# Altium schematic sheet ATX.SchDoc
size A4
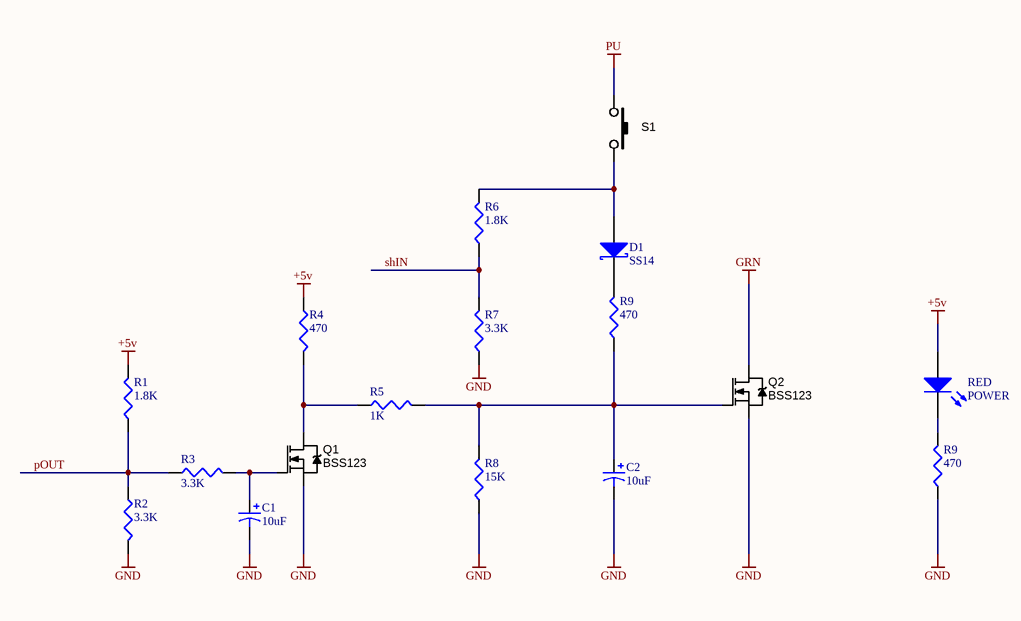
[diagram p0: ATX.SchDoc]

## Parts
(Parts that share a designator on the sheet are numbered #1, #2 ... from top to bottom, then left to right.)
C1  value 10uF  [C0805]  (hidden comment: Cap Pol3)
C2  value 10uF  [C0805]  (hidden comment: Cap Pol3)
D1  SS14  [SMA]
Q1  BSS123  [SOT23-3]
Q2  BSS123  [SOT23-3]
R1  value 1.8K  [J1-0603]  (hidden comment: Res3)
R2  value 3.3K  [J1-0603]  (hidden comment: Res3)
R3  value 3.3K  [J1-0603]  (hidden comment: Res3)
R4  value 470  [J1-0603]  (hidden comment: Res3)
R5  value 1K  [J1-0603]  (hidden comment: Res3)
R6  value 1.8K  [J1-0603]  (hidden comment: Res3)
R7  value 3.3K  [J1-0603]  (hidden comment: Res3)
R8  value 15K  [J1-0603]  (hidden comment: Res3)
R9#1  value 470  [J1-0603]  (hidden comment: Res3)
R9#2  value 470  [J1-0603]  (hidden comment: Res3)
RED  POWER  [3.5X2.8X1.9]
S1  TS-1143S-WP  [TS-1143S]  (value not drawn)

## Nets
+5v: R1.2 R4.1 RED.1(A)
GND: C1.2 C2.2 Q1.2(S) Q2.2(S) R2.2 R7.1 R8.1 R9#2.1
GRN: Q2.3(D)
PU: S1.1
pOUT: R1.1 R2.1 R3.1
shIN: R6.1 R7.2
NetC1_1: C1.1 Q1.1(G) R3.2
NetC2_1: C2.1 Q2.1(G) R5.2 R8.2 R9#1.1
NetD1_1: D1.1(A) R6.2 S1.2
NetD1_2: D1.2(K) R9#1.2
NetQ1_3: Q1.3(D) R4.2 R5.1
NetR9#2_2: R9#2.2 RED.2(K)

## Library data of the parts
C1 C2 = Cap Pol3: Polarized Capacitor (Surface Mount); Published: 8-Jun-2000; LatestRevisionDate: 29-May-2009; LatestRevisionNote: IPC-7351 Footprint Added.; PackageReference: C0805; Publisher: Altium Limited; PackageDescription: Chip Capacitor
D1 = 10MQ060N: Schottky Rectifier; Published: 17-Sep-2003; DatasheetVersion: May-2002; PackageVersion: revH, May-2002; PackageReference: SMA; Publisher: Altium Limited; PackageDescription: DO-214-AC/SMA; 2 C-Bend Leads; Body 5 x 2.7 mm, inc. leads (LxW); ComponentLink1Description: Manufacturer Link; ComponentLink1URL: http://www.irf.com/; ComponentLink2Description: Datasheet; ComponentLink2URL: http://www.irf.com/product-info/datasheets/data/10MQ060N.pdf; Supplier Part Number 1: SS14-E3/61TGICT-ND; Supplier 1: Digi-Key
Q1 Q2 = MOSFET_BSS123: MOSFET SMD N-CH 100V 170mA SOT23-3; Manufacturer 1: Diodes Inc; Manufacturer Part Number 1: BSS123-7-F; Ratings: 100V; 170mA; Material: Metal Oxide; SCDType: source; Package / Case: SOT23-3; Supplier 1: Digi-Key; Supplier Part Number 1: BSS123-FDICT-ND
R1-R8 R9#1 R9#2 = Res3: Resistor; Published: 8-Jun-2000; LatestRevisionDate: 29-May-2009; LatestRevisionNote: IPC-7351 Footprint Added.; PackageReference: J1-0603; Publisher: Altium Limited; PackageDescription: Chip Resistor
RED = LED3: Typical BLUE SiC LED; Published: 8-Jun-2000; LatestRevisionDate: 17-Dec-2003; LatestRevisionNote: PCB Footprint replaced.; DatasheetVersion: 16-Apr-2002; PackageVersion: 16-Apr-2002; PackageReference: 3.5X2.8X1.9; Publisher: Altium Limited; PackageDescription: SM LED; 2 C-Bend Leads; Body 3.5 x 2.8 x 1.9 mm, inc leads (LxWxH typ); Supplier Part Number 1: 732-4995-1-ND; Supplier 1: Digi-Key
S1 = SW_SMD_PB_4.3mm: Switch SMD Tact 4.3mm Stem; Manufacturer 1: Bond-Tact; Manufacturer Part Number 1: TS-1143S-WP-200; SCDType: spec; Function: On/Off; Package / Case: 6.5x6.5mm; 4.3mm stem; Supplier Part Number 1: CKN10304CT-ND; Supplier 1: Digi-Key